# Altium schematic sheet LCDTestor_CPLD.SchDoc
size A2
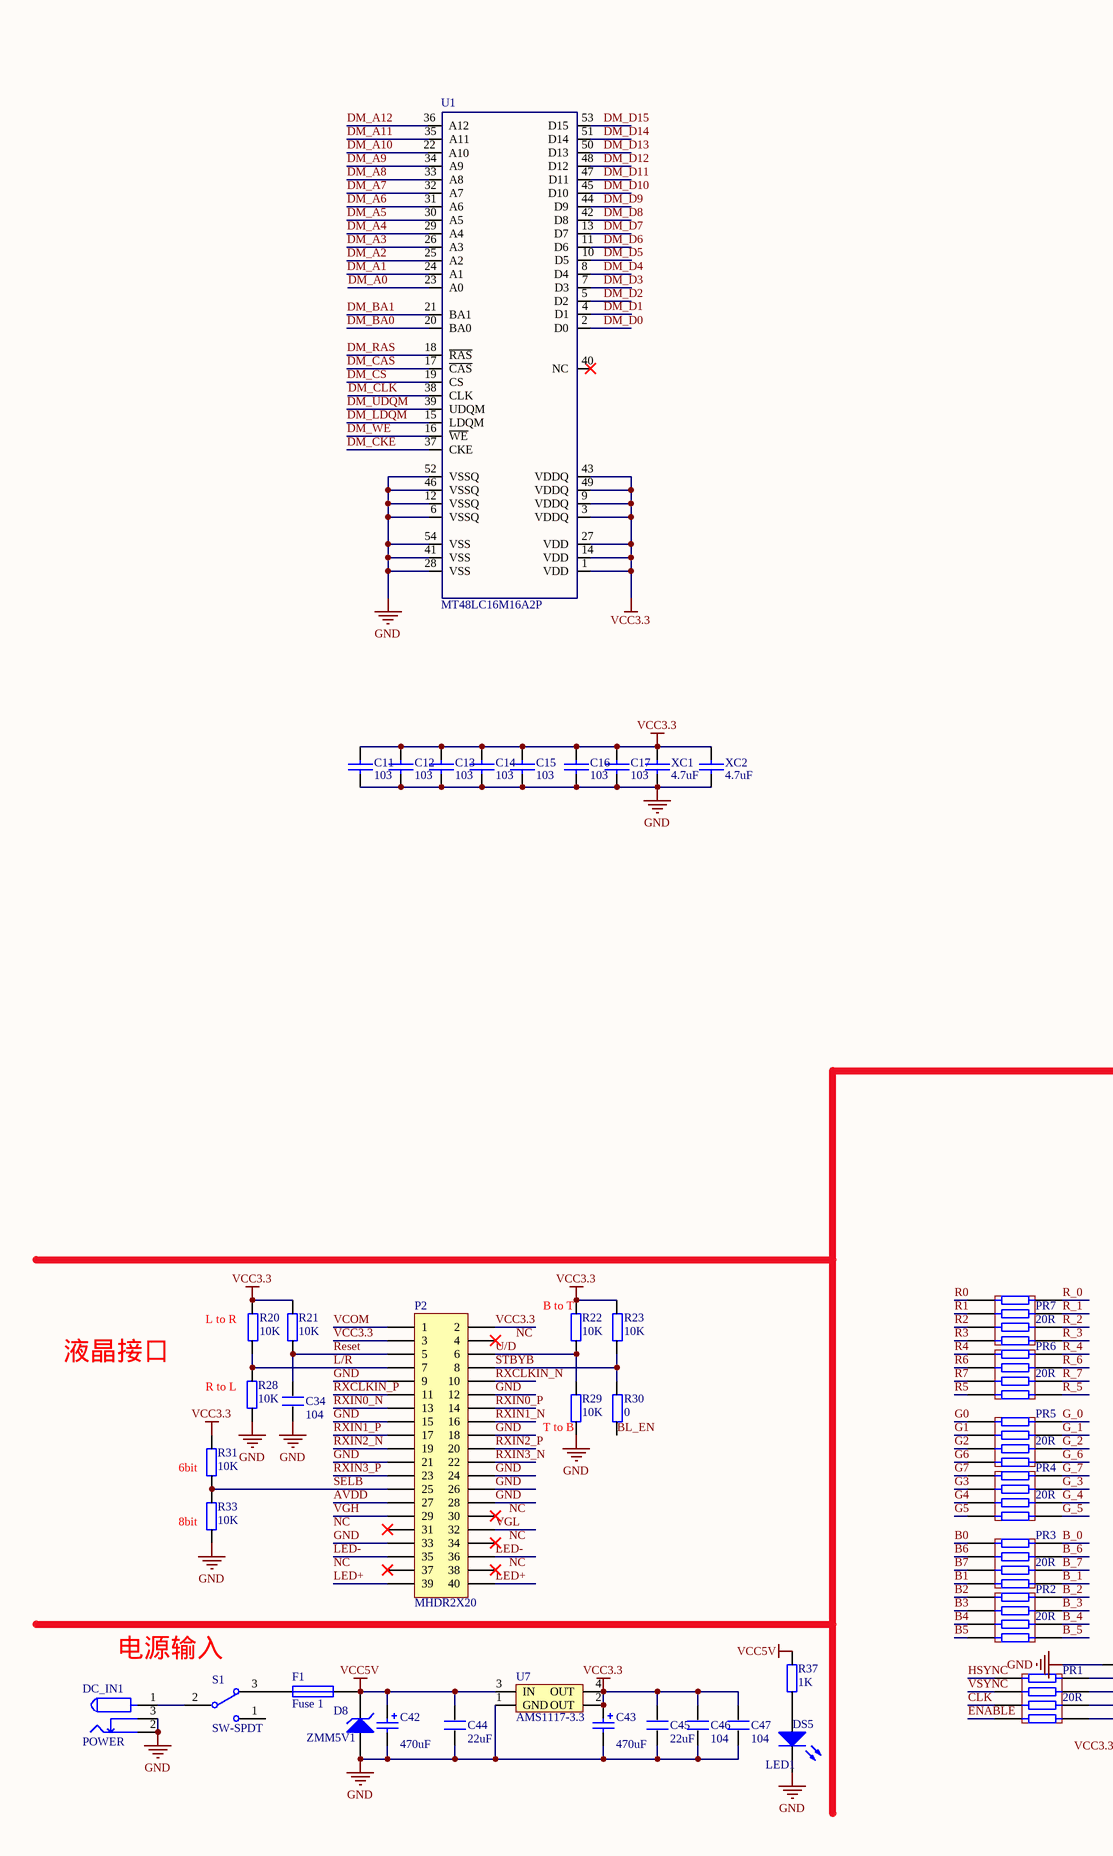
[diagram p0: LCDTestor_CPLD.SchDoc, left]
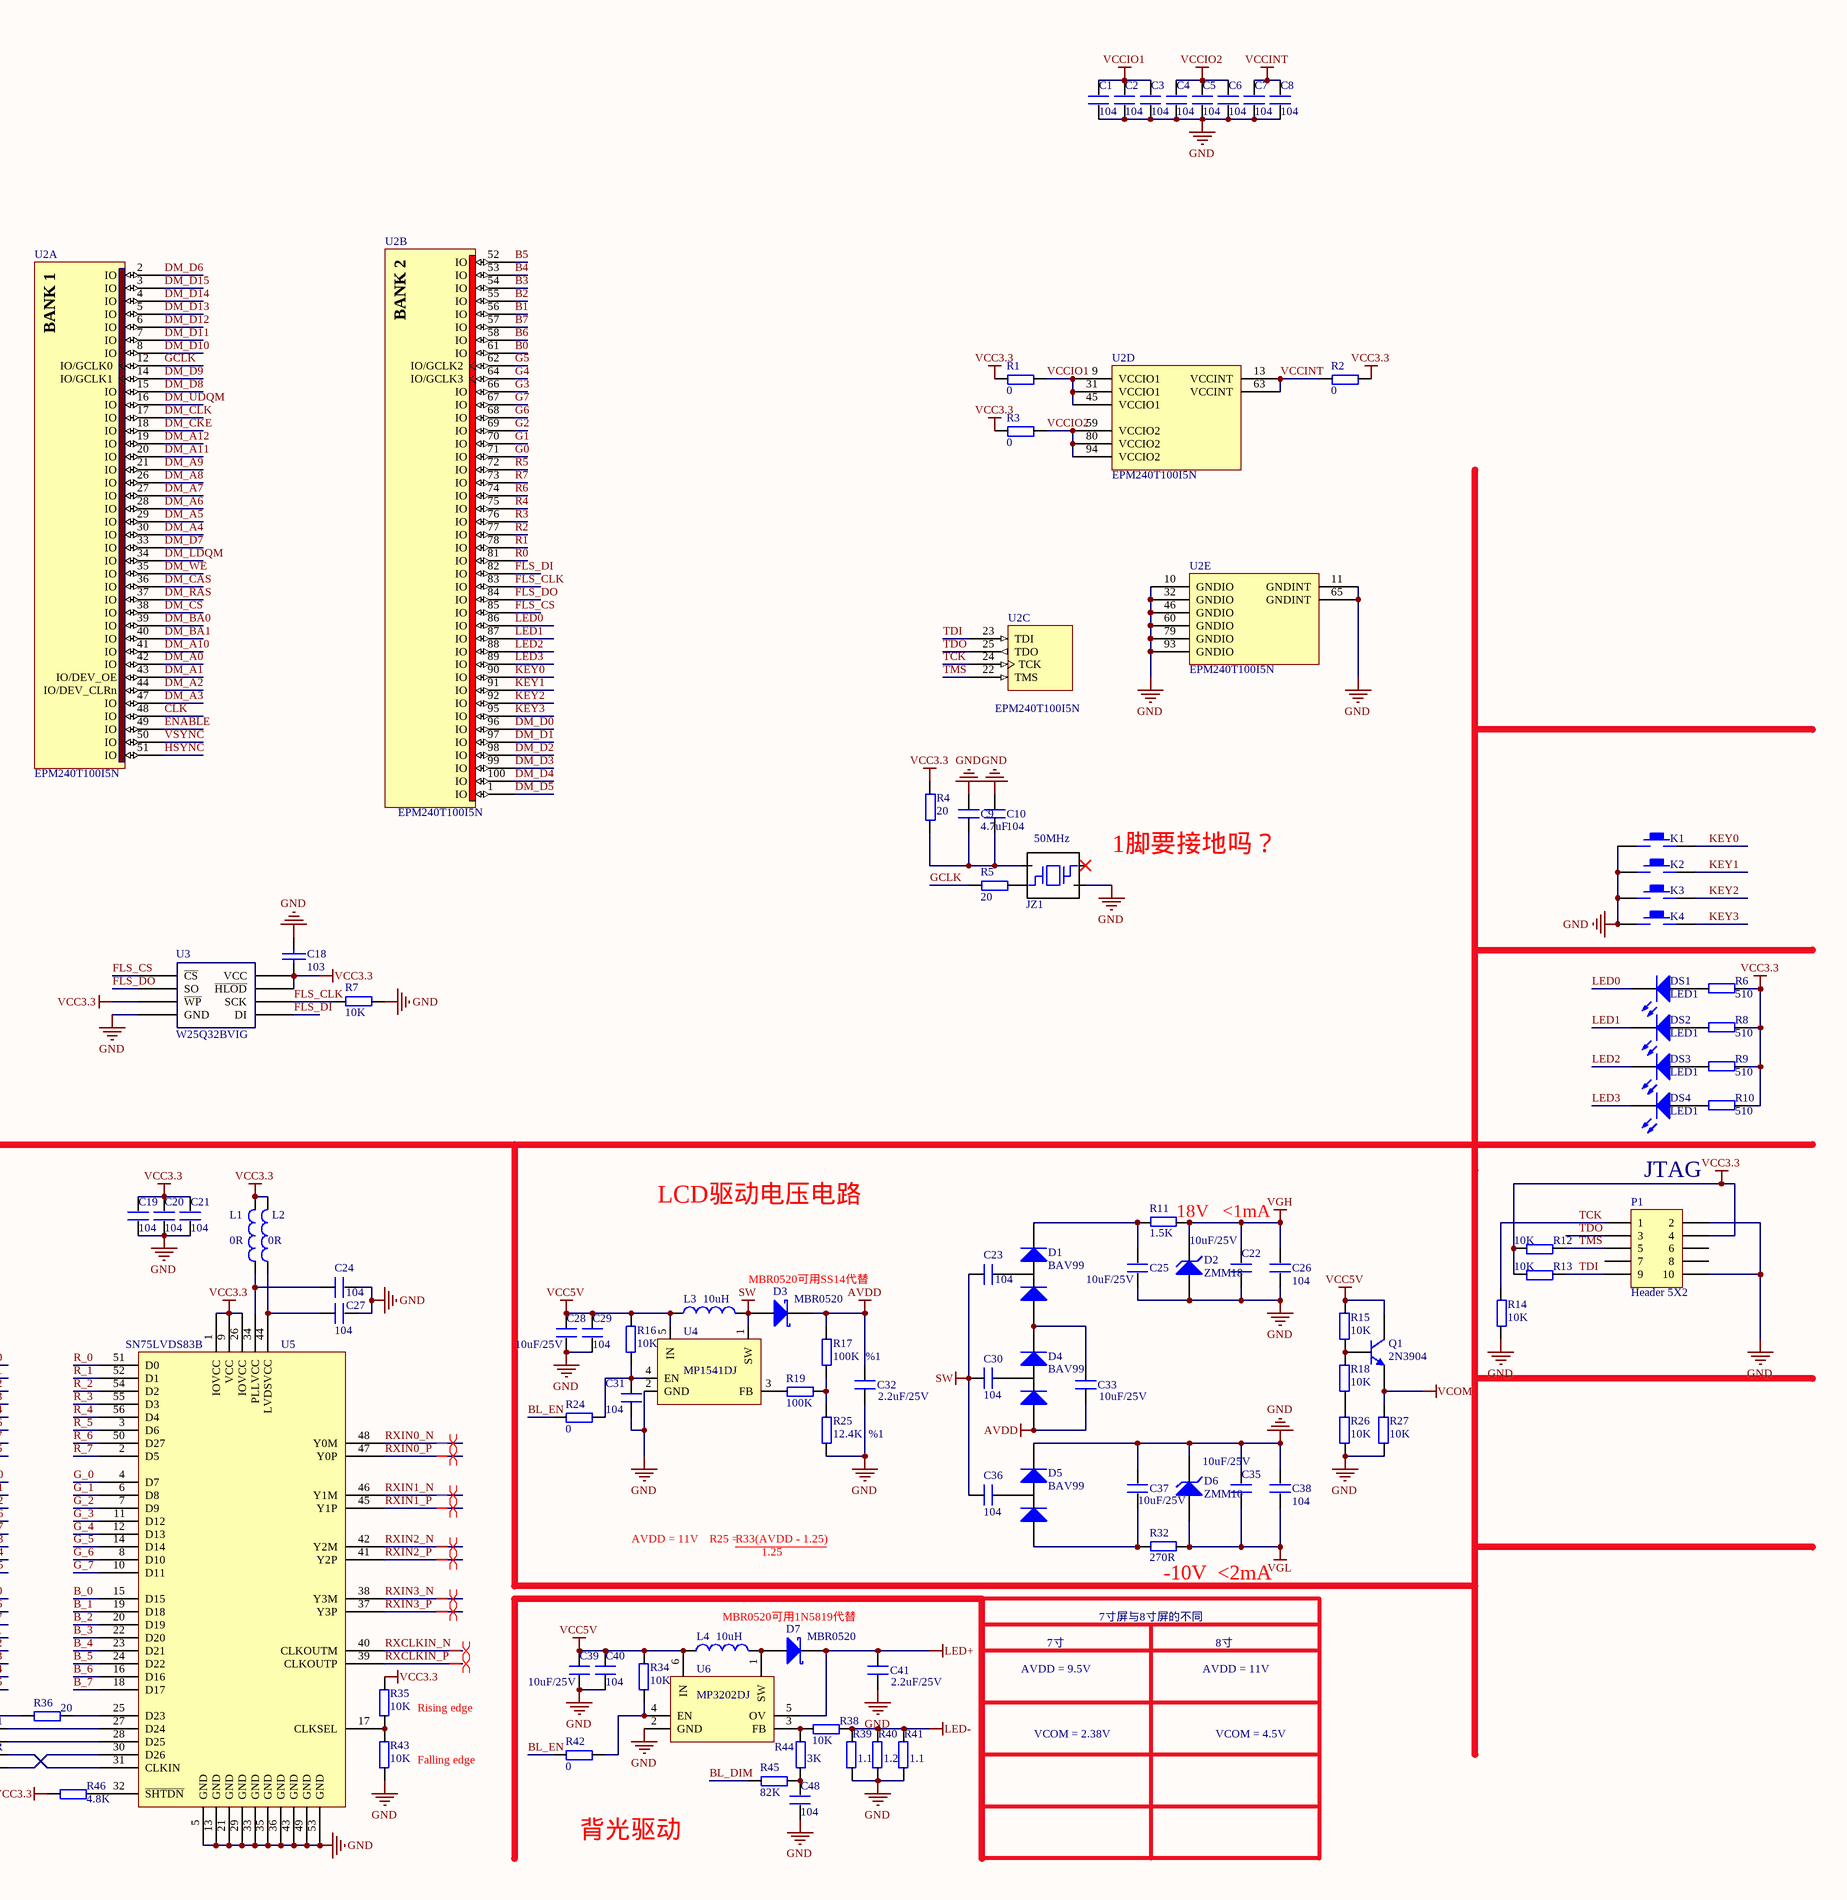
[diagram p1: LCDTestor_CPLD.SchDoc, right]

## Parts
C1  104  [0603]
C2  104  [0603]
C3  104  [0603]
C4  104  [0603]
C5  104  [0603]
C6  104  [0603]
C7  104  [0603]
C8  104  [0603]
C9  4.7uF  [0805]
C10  104  [0603]
C11  103  [0603]
C12  103  [0603]
C13  103  [0603]
C14  103  [0603]
C15  103  [0603]
C16  103  [0603]
C17  103  [0603]
C18  103  [0603]
C19  104  [0603]
C20  104  [0603]
C21  104  [0603]
C22  10uF/25V  [1206]
C23  104  [0603]
C24  104  [0603]
C25  10uF/25V  [1206]
C26  104  [0603]
C27  104  [0603]
C28  10uF/25V  [1206]
C29  104  [0603]
C30  104  [0603]
C31  104  [0603]
C32  2.2uF/25V  [1206]
C33  10uF/25V  [1206]
C34  104  [0603]
C35  10uF/25V  [1206]
C36  104  [0603]
C37  10uF/25V  [1206]
C38  104  [0603]
C39  10uF/25V  [1206]
C40  104  [0603]
C41  2.2uF/25V  [1206]
C42  value 470uF  [SMD06]  (hidden comment: Cap Tantalum)
C43  value 470uF  [0805]  (hidden comment: Cap Tantalum)
C44  22uF  [0603]
C45  22uF  [0603]
C46  104  [0603]
C47  104  [0603]
C48  104  [0603]
D1  BAV99  [SOT-23-3L]
D2  ZMM18  [LL-34]
D3  MBR0520  [DSO-C2/X2.3]
D4  BAV99  [SOT-23-3L]
D5  BAV99  [SOT-23-3L]
D6  ZMM10  [LL-34]
D7  MBR0520  [DSO-C2/X2.3]
D8  ZMM5V1  [LL-34]
DC_IN1  POWER  [DC10B]
DS1  LED1  [SMDLED]
DS2  LED1  [SMDLED]
DS3  LED1  [SMDLED]
DS4  LED1  [SMDLED]
DS5  LED1  [SMDLED]
F1  Fuse 1  [0805]
JZ1  50MHz  [Q5*7]
K1  KEY_M  [K贴片]  (value not drawn)
K2  KEY_M  [K贴片]  (value not drawn)
K3  KEY_M  [K贴片]  (value not drawn)
K4  KEY_M  [K贴片]  (value not drawn)
L1  value 0R  [0603]  (hidden comment: Inductor)
L2  value 0R  [0603]  (hidden comment: Inductor)
L3  value 10uH  [1206]  (hidden comment: Inductor)
L4  value 10uH  [1206]  (hidden comment: Inductor)
P1  Header 5X2  [HDR2X5]
P2  MHDR2X20  [FH12A-40S-0.5SH]
PR1  20R  [0603_4]
PR2  20R  [0603_4]
PR3  20R  [0603_4]
PR4  20R  [0603_4]
PR5  20R  [0603_4]
PR6  20R  [0603_4]
PR7  20R  [0603_4]
Q1  2N3904  [SOT-23-3L]
R1  0  [0603]
R2  0  [0603]
R3  0  [0603]
R4  20  [0603]
R5  20  [0603]
R6  510  [0603]
R7  10K  [0603]
R8  510  [0603]
R9  510  [0603]
R10  510  [0603]
R11  1.5K  [0603]
R12  10K  [0603]
R13  10K  [0603]
R14  10K  [0603]
R15  10K  [0603]
R16  10K  [0603]
R17  100K  %1  [0603]
R18  10K  [0603]
R19  100K  [0603]
R20  10K  [0603]
R21  10K  [0603]
R22  10K  [0603]
R23  10K  [0603]
R24  0  [0603]
R25  12.4K  %1  [0603]
R26  10K  [0603]
R27  10K  [0603]
R28  10K  [0603]
R29  10K  [0603]
R30  0  [0603]
R31  10K  [0603]
R32  270R  [0603]
R33  10K  [0603]
R34  10K  [0603]
R35  10K  [0603]
R36  20  [0603]
R37  1K  [0603]
R38  10K  [0603]
R39  1.1  [0603]
R40  1.2  [0603]
R41  1.1  [0603]
R42  0  [0603]
R43  10K  [0603]
R44  3K  [0603]
R45  82K  [0603]
R46  4.8K  [0603]
S1  SW-SPDT  [自锁开关6]
U1  MT48LC16M16A2P  [TSSOP54]
U2  EPM240T100I5N  [TQFP-100]  (parts A,B,C,D,E of 5)
U3  W25Q32BVIG  [8S2]
U4  MP1541DJ  [SOT-23-5L]
U5  SN75LVDS83B  [DGG056]
U6  MP3202DJ  [SOT-23-6L]
U7  AMS1117-3.3  [AMS1117]
XC1  4.7uF  [0805]
XC2  4.7uF  [0805]

## Nets
AVDD: C32.1 C33.2 D3.2(K) D4.1(A) P2.27 R17.2
GND: C1.1 C2.1 C3.1 C4.1 C5.1 C6.1 C7.1 C8.1 C9.1 C10.1 C11.2 C12.2 C13.2 C14.2 C15.2 C16.2 C17.2 C18.2 C19.1 C20.1 C21.1 C22.2 C24.1 C25.2 C26.2 C27.1 C28.2 C29.1 C31.1 C32.2 C34.1 C35.1 C37.1 C38.1 C39.2 C40.1 C41.2 C42.2 C43.2 C44.1 C45.1 C46.1 C47.1 C48.1 D2.1(A) D5.2(K) D6.2(K) D8.1(A) DC_IN1.2 DC_IN1.3 DS5.2(K) JZ1.2 K1.1 K2.1 K3.1 K4.1 P1.2 P1.10 P2.9 P2.12 P2.15 P2.18 P2.21 P2.24 P2.26 P2.28 P2.33 R7.1 R14.1 R25.1 R26.2 R27.2 R28.2 R29.2 R33.2 R36.1 R39.2 R40.2 R41.2 R43.2 U1.6(VSSQ) U1.12(VSSQ) U1.28(VSS) U1.41(VSS) U1.46(VSSQ) U1.52(VSSQ) U1.54(VSS) U2.10(GNDIO) U2.11(GNDINT) U2.32(GNDIO) U2.46(GNDIO) U2.60(GNDIO) U2.65(GNDINT) U2.79(GNDIO) U2.93(GNDIO) U3.4(GND) U4.2(GND) U5.5(GND) U5.13(GND) U5.21(GND) U5.29(GND) U5.33(GND) U5.35(GND) U5.36(GND) U5.43(GND) U5.49(GND) U5.53(GND) U6.2(GND) U7.1(GND) XC1.2 XC2.2
LED+: C41.1 D7.2(K) P2.39 P2.40 U6.5(OV)
LED-: P2.35 P2.36 R38.2 R39.1 R40.1 R41.1
SW: C23.2 C30.1 C36.1 D3.1(A) L3.2 U4.1(SW)
VCC3.3: C11.1 C12.1 C13.1 C14.1 C15.1 C16.1 C17.1 C18.1 C19.2 C20.2 C21.2 C43.1 C45.2 C46.2 C47.2 L1.2 L2.2 P1.4 P2.2 P2.3 R1.1 R2.1 R3.1 R4.2 R6.1 R8.1 R9.1 R10.1 R12.1 R13.1 R20.2 R21.1 R22.1 R23.2 R31.1 R35.1 R46.1 U1.1(VDD) U1.3(VDDQ) U1.9(VDDQ) U1.14(VDD) U1.27(VDD) U1.43(VDDQ) U1.49(VDDQ) U3.3(~{WP}) U3.7(~{HLOD}) U3.8(VCC) U5.1(IOVCC) U5.9(VCC) U5.26(IOVCC) U7.2(OUT) U7.4(OUT) XC1.1 XC2.1
VCC5V: C28.1 C29.2 C39.1 C40.2 C42.1 C44.2 D8.2(K) F1.2 L3.1 L4.1 Q1.3(C) R15.1 R16.1 R34.1 R37.1 U4.5(IN) U6.6(IN) U7.3(IN)
VCCINT: C7.2 C8.2 R2.2 U2.13(VCCINT) U2.63(VCCINT)
VCCIO1: C1.2 C2.2 C3.2 R1.2 U2.9(VCCIO1) U2.31(VCCIO1) U2.45(VCCIO1)
VCCIO2: C4.2 C5.2 C6.2 R3.2 U2.59(VCCIO2) U2.80(VCCIO2) U2.94(VCCIO2)
VCOM: P2.1 Q1.2(E) R27.1
VGH: C22.1 C26.1 D2.2(K) P2.29 R11.1
VGL: C35.2 C38.2 D6.1(A) P2.32 R32.1
B0: PR3.5 U2.61(IO)
B1: PR3.8 U2.56(IO)
B2: PR2.5 U2.55(IO)
B3: PR2.6 U2.54(IO)
B4: PR2.7 U2.53(IO)
B5: PR2.8 U2.52(IO)
B6: PR3.6 U2.58(IO)
B7: PR3.7 U2.57(IO)
B_0: PR3.4 U5.15(D15)
B_1: PR3.1 U5.19(D18)
B_2: PR2.4 U5.20(D19)
B_3: PR2.3 U5.22(D20)
B_4: PR2.2 U5.23(D21)
B_5: PR2.1 U5.24(D22)
B_6: PR3.3 U5.16(D16)
B_7: PR3.2 U5.18(D17)
BL_DIM: R45.1
BL_EN: R24.1 R30.1 R42.1
CLK: PR1.7 U2.48(IO)
DM_A0: U1.23(A0) U2.42(IO)
DM_A1: U1.24(A1) U2.43(IO/DEV_OE)
DM_A2: U1.25(A2) U2.44(IO/DEV_CLRn)
DM_A3: U1.26(A3) U2.47(IO)
DM_A4: U1.29(A4) U2.30(IO)
DM_A5: U1.30(A5) U2.29(IO)
DM_A6: U1.31(A6) U2.28(IO)
DM_A7: U1.32(A7) U2.27(IO)
DM_A8: U1.33(A8) U2.26(IO)
DM_A9: U1.34(A9) U2.21(IO)
DM_A10: U1.22(A10) U2.41(IO)
DM_A11: U1.35(A11) U2.20(IO)
DM_A12: U1.36(A12) U2.19(IO)
DM_BA0: U1.20(BA0) U2.39(IO)
DM_BA1: U1.21(BA1) U2.40(IO)
DM_CAS: U1.17(~{CAS}) U2.36(IO)
DM_CKE: U1.37(CKE) U2.18(IO)
DM_CLK: U1.38(CLK) U2.17(IO)
DM_CS: U1.19(CS) U2.38(IO)
DM_D0: U1.2(D0) U2.96(IO)
DM_D1: U1.4(D1) U2.97(IO)
DM_D2: U1.5(D2) U2.98(IO)
DM_D3: U1.7(D3) U2.99(IO)
DM_D4: U1.8(D4) U2.100(IO)
DM_D5: U1.10(D5) U2.1(IO)
DM_D6: U1.11(D6) U2.2(IO)
DM_D7: U1.13(D7) U2.33(IO)
DM_D8: U1.42(D8) U2.15(IO)
DM_D9: U1.44(D9) U2.14(IO/GCLK1)
DM_D10: U1.45(D10) U2.8(IO)
DM_D11: U1.47(D11) U2.7(IO)
DM_D12: U1.48(D12) U2.6(IO)
DM_D13: U1.50(D13) U2.5(IO)
DM_D14: U1.51(D14) U2.4(IO)
DM_D15: U1.53(D15) U2.3(IO)
DM_LDQM: U1.15(LDQM) U2.34(IO)
DM_RAS: U1.18(~{RAS}) U2.37(IO)
DM_UDQM: U1.39(UDQM) U2.16(IO)
DM_WE: U1.16(~{WE}) U2.35(IO)
ENABLE: PR1.8 U2.49(IO)
FLS_CLK: R7.2 U2.83(IO) U3.6(SCK)
FLS_CS: U2.85(IO) U3.1(~{CS})
FLS_DI: U2.82(IO) U3.5(DI)
FLS_DO: U2.84(IO) U3.2(SO)
G0: PR5.5 U2.71(IO)
G1: PR5.6 U2.70(IO)
G2: PR5.7 U2.69(IO)
G3: PR4.6 U2.66(IO)
G4: PR4.7 U2.64(IO/GCLK3)
G5: PR4.8 U2.62(IO/GCLK2)
G6: PR5.8 U2.68(IO)
G7: PR4.5 U2.67(IO)
G_0: PR5.4 U5.4(D7)
G_1: PR5.3 U5.6(D8)
G_2: PR5.2 U5.7(D9)
G_3: PR4.3 U5.11(D12)
G_4: PR4.2 U5.12(D13)
G_5: PR4.1 U5.14(D14)
G_6: PR5.1 U5.8(D10)
G_7: PR4.4 U5.10(D11)
GCLK: R5.1 U2.12(IO/GCLK0)
HSYNC: PR1.5 U2.51(IO)
KEY0: K1.2 U2.90(IO)
KEY1: K2.2 U2.91(IO)
KEY2: K3.2 U2.92(IO)
KEY3: K4.2 U2.95(IO)
L/R: P2.7 R20.1 R28.1
LED0: DS1.2(K) U2.86(IO)
LED1: DS2.2(K) U2.87(IO)
LED2: DS3.2(K) U2.88(IO)
LED3: DS4.2(K) U2.89(IO)
R0: PR7.5 U2.81(IO)
R1: PR7.6 U2.78(IO)
R2: PR7.7 U2.77(IO)
R3: PR7.8 U2.76(IO)
R4: PR6.5 U2.75(IO)
R5: PR6.8 U2.72(IO)
R6: PR6.6 U2.74(IO)
R7: PR6.7 U2.73(IO)
R_0: PR7.4 U5.51(D0)
R_1: PR7.3 U5.52(D1)
R_2: PR7.2 U5.54(D2)
R_3: PR7.1 U5.55(D3)
R_4: PR6.4 U5.56(D4)
R_5: PR6.1 U5.3(D6)
R_6: PR6.3 U5.50(D27)
R_7: PR6.2 U5.2(D5)
Reset: C34.2 P2.5 R21.2
RXCLKIN_N: P2.10 U5.40(CLKOUTM)
RXCLKIN_P: P2.11 U5.39(CLKOUTP)
RXIN0_N: P2.13 U5.48(Y0M)
RXIN0_P: P2.14 U5.47(Y0P)
RXIN1_N: P2.16 U5.46(Y1M)
RXIN1_P: P2.17 U5.45(Y1P)
RXIN2_N: P2.19 U5.42(Y2M)
RXIN2_P: P2.20 U5.41(Y2P)
RXIN3_N: P2.22 U5.38(Y3M)
RXIN3_P: P2.23 U5.37(Y3P)
SELB: P2.25 R31.2 R33.1
STBYB: P2.8 R23.1 R30.2
TCK: P1.1 R14.2 U2.24(TCK)
TDI: P1.9 R13.2 U2.23(TDI)
TDO: P1.3 U2.25(TDO)
TMS: P1.5 R12.2 U2.22(TMS)
U/D: P2.6 R22.2 R29.1
VSYNC: PR1.6 U2.50(IO)
NetC9_2: C9.2 C10.2 JZ1.4 R4.1
NetC23_1: C23.1 D1.3(A)
NetC24_2: C24.2 L1.1 U5.34(PLLVCC)
NetC25_1: C25.1 D1.2(K) R11.2
NetC27_2: C27.2 L2.1 U5.44(LVDSVCC)
NetC30_2: C30.2 D4.3(A)
NetC31_2: C31.2 R16.2 R24.2 U4.4(EN)
NetC33_1: C33.1 D1.1(A) D4.2(K)
NetC36_2: C36.2 D5.3(A)
NetC37_2: C37.2 D5.1(A) R32.2
NetC48_2: C48.2 R44.1 R45.2
NetD7_1: D7.1(A) L4.2 U6.1(SW)
NetDC_IN1_1: DC_IN1.1 S1.2
NetDS1_1: DS1.1(A) R6.2
NetDS2_1: DS2.1(A) R8.2
NetDS3_1: DS3.1(A) R9.2
NetDS4_1: DS4.1(A) R10.2
NetDS5_1: DS5.1(A) R37.2
NetF1_1: F1.1 S1.3
NetJZ1_3: JZ1.3 R5.2
NetPR1_1: PR1.1 U5.30(D26)
NetPR1_2: PR1.2 U5.31(CLKIN)
NetPR1_3: PR1.3 U5.28(D25)
NetPR1_4: PR1.4 U5.27(D24)
NetQ1_1: Q1.1(B) R15.2 R18.1
NetR17_1: R17.1 R19.2 R25.2
NetR18_2: R18.2 R26.1
NetR19_1: R19.1 U4.3(FB)
NetR34_2: R34.2 R42.2 U6.4(EN)
NetR35_2: R35.2 R43.1 U5.17(CLKSEL)
NetR36_2: R36.2 U5.25(D23)
NetR38_1: R38.1 R44.2 U6.3(FB)
NetR46_2: R46.2 U5.32(~{SHTDN})

Not connected (* = marked no-connect by the designer): JZ1 1*; P1 6 7 8; P2 4* 30* 31* 34* 37* 38*; S1 1; U1 40(NC)*

## Layout directives
differential pair: RXCLKIN_N, RXCLKIN_P, RXIN0_N, RXIN0_P, RXIN1_N, RXIN1_P, RXIN2_N, RXIN2_P, RXIN3_N, RXIN3_P

## Notes on the sheet
- (near JZ1) 1脚要接地吗？
- LCD驱动电压电路
- JTAG
- (near R11) 18V   <1mA
- MBR0520可用SS14代替
- (near R20) L to R
- (near R22) B to T
- 液晶接口
- (near R28) R to L
- (near R31) 6bit
- (near R29) T to B
- (near R33) 8bit
- AVDD = 11V
- R25 =
- R33(AVDD - 1.25)
- 1.25
- (near R32) -10V  <2mA
- MBR0520可用1N5819代替
- 7寸
- 7寸屏与8寸屏的不同
- 8寸
- 电源输入
- Rising edge
- AVDD = 9.5V
- Falling edge
- VCOM = 2.38V
- VCOM = 4.5V
- 背光驱动
- Labels drawn without touching a wire or pin: NC
- (in symbol EPM240T100I5N, part A) BANK 1
- (in symbol EPM240T100I5N, part B) BANK 2

## Library data of the parts
C1-C10 C19-C41 C48 = C
C11-C18 XC1 XC2 = CAP: Capacitor
C42 C43 = Cap Tantalum: Polarized Capacitor (Surface Mount); Published: LatestRevisionDate; LatestRevisionDate: 2014-11-15; LatestRevisionNote: IPC-7351 Footprint Added.; PackageReference: C0805; Publisher: Am; PackageDescription: Chip Capacitor
C44-C47 = C_2
D2 D6 D8 = D Zener: Zener Diode; Published: 8-Jun-2000; LatestRevisionDate: 17-Jul-2002; LatestRevisionNote: Re-released for DXP Platform.; PackageReference: DIODE-0.7; Publisher: Altium Limited
D3 D7 = D Schottky: Schottky Diode; Published: 8-Jun-2000; LatestRevisionDate: 17-Jul-2002; LatestRevisionNote: Re-released for DXP Platform.; PackageReference: SMB; Publisher: Altium Limited; Code_JEDEC: DO-214-AA
DC_IN1 = POW
DS1-DS5 = LED2: Typical RED, GREEN, YELLOW, AMBER GaAs LED; Published: 8-Jun-2000; LatestRevisionDate: 17-Jul-2002; LatestRevisionNote: Re-released for DXP Platform.; PackageDocument: Feb-2002; PackageReference: 3.2X1.6X1.1; Publisher: Altium Limited
F1 = Fuse 1: Fuse; Published: 8-Jun-2000; LatestRevisionDate: 17-Jul-2002; LatestRevisionNote: Re-released for DXP Platform.; PackageReference: PIN-W2/E2.8; Publisher: Altium Limited
JZ1 = JZ-4P: 4脚晶振; pin to pad: 0>1
L1-L4 = Inductor: Code_IEC: 1005; Published: 8-Jun-2000; LatestRevisionDate: 29-May-2009; LatestRevisionNote: IPC-7351 Footprint Added.; PackageReference: 0402-A; Publisher: Altium Limited; PackageDescription: Chip Inductor; Code_JEITA: 0402
P1 = Header 5X2: Header, 5-Pin, Dual row; LatestRevisionDate: 17-Jul-2002; LatestRevisionNote: Re-released for DXP Platform.; Publisher: Altium Limited
P2 = MHDR2X20: Header, 20-Pin, Dual row; LatestRevisionDate: 17-Jul-2002; LatestRevisionNote: Re-released for DXP Platform.; Publisher: Altium Limited
PR1-PR7 = PR-4
Q1 = 2N3904: NPN General Purpose Amplifier; Published: 8-Jun-2000; LatestRevisionDate: 15-Jan-2003; LatestRevisionNote: PCB Footprint 'BCY-W3/D4.7' replaced; DatasheetVersion: 1997; PackageVersion: Sep-1998; PackageReference: TO-92A; Publisher: Altium Limited; Code_JEDEC: TO-92A; ComponentLink1Description: Manufacturer Link; ComponentLink1URL: http://www.fairchildsemi.com/; ComponentLink2Description: Datasheet; ComponentLink2URL: http://www.fairchildsemi.com/ds/2N%2F2N3904.pdf
R1-R46 = R
S1 = SW-SPDT: SPDT Subminiature Toggle Switch, Right Angle Mounting, Vertical Actuation; Published: 24-Mar-1999; LatestRevisionDate: 17-Dec-2003; LatestRevisionNote: Schematic revised, PCB Footprint replaced.; DatasheetVersion: 05-Dec-2000; PackageReference: TL36WW15050; Publisher: Altium Limited; ComponentLink1Description: Manufacturer Link; ComponentLink1URL: http://www.apem.com
U2 = EPM240T100I5N: MAX II 3.3/2.5V CPLD, 80 IOs, 240 Logic Elements, 100-Pin Plastic TQFP, Industrial Temperature, Speed Grade 5, Pb-Free; Note: Each set of VCCIO pins can be connected to 3.3V, 2.5V, 1.8V, or 1.5V.; Note: All VCCINT pins must be connected to either 3.3V or 2.5V (but not a combination of both).; Published: 18-Aug-2005; LatestRevisionDate: 13-Apr-2006; LatestRevisionNote: IPC-7351 Footprint Added.; DatasheetVersion: ver1.8, Jul-2006; PackageVersion: ver14.3, Jul-2006; PackageReference: TQFP100; Publisher: Altium Limited; PackageDescription: 100-Pin Plastic Thin Quad Flat Pack (TQFP100); Code_JEDEC: MS-026-AED; ComponentLink1Description: Manufacturer Link; ComponentLink1URL: http://www.altera.com/products/devices/cpld/max2/mx2-index.jsp; ComponentLink2Description: Handbook; ComponentLink2URL: http://www.altera.com/literature/hb/max2/max2_mii5v1.pdf; ComponentLink3Description: Packaging Specification; ComponentLink3URL: http://www.altera.com/literature/ds/dspkg.pdf
U4 = MP1541
U6 = MP3202
U7 = AMS1117